# EAGLE design WifiDriver (EAGLE 9.6.2)
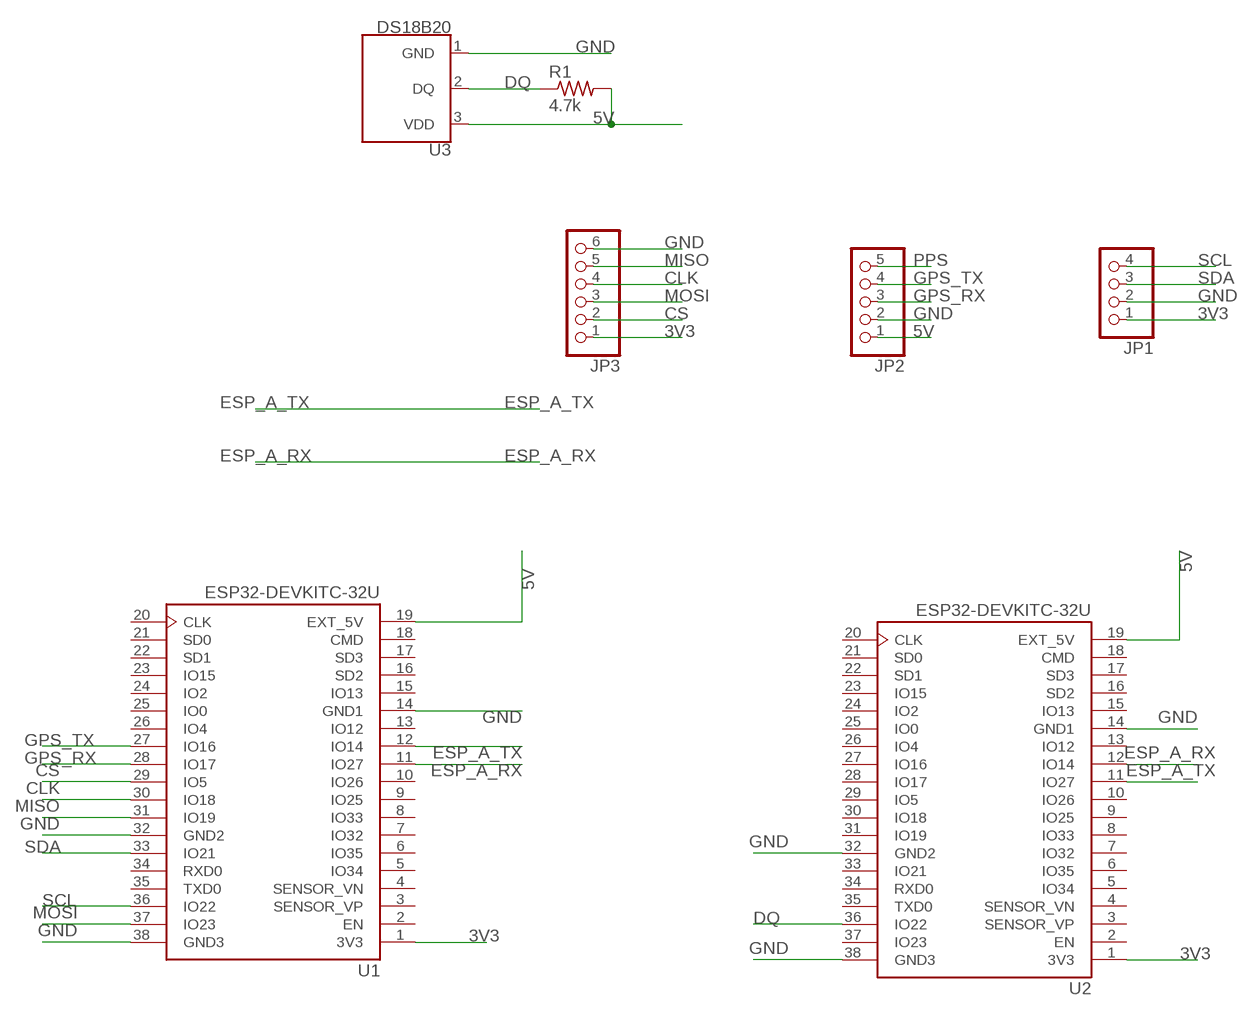
[diagram p0: schematic, sheet 1]

## Parts
JP1  PINHD-1X4  [1X04]
JP2  PINHD-1X5  [1X05]
JP3  PINHD-1X6  [1X06]
R1  4.7k  FLIPFLOP-RES  [0805-THM]
U1  ESP32-DEVKITC-32U  [MODULE_ESP32-DEVKITC-32U]
U2  ESP32-DEVKITC-32U  [MODULE_ESP32-DEVKITC-32U]
U3  DS18B20  [TO-92-AMMO]

## Nets
3V3: JP1.1 JP3.1 U1.1(3V3) U2.1(3V3)
5V: JP2.1 R1.2 U1.19(EXT_5V) U2.19(EXT_5V) U3.3(VDD)
CLK: JP3.4 U1.30(IO18)
CS: JP3.2 U1.29(IO5)
DQ: R1.1 U2.36(IO22) U3.2(DQ)
ESP_A_RX: U1.11(IO27) U2.12(IO14)
ESP_A_TX: U1.12(IO14) U2.11(IO27)
GND: JP1.2 JP2.2 JP3.6 U1.14(GND1) U1.32(GND2) U1.38(GND3) U2.14(GND1) U2.32(GND2) U2.38(GND3) U3.1(GND)
GPS_RX: JP2.3 U1.28(IO17)
GPS_TX: JP2.4 U1.27(IO16)
MISO: JP3.5 U1.31(IO19)
MOSI: JP3.3 U1.37(IO23)
PPS: JP2.5
SCL: JP1.4 U1.36(IO22)
SDA: JP1.3 U1.33(IO21)
Unconnected: U1.2(EN) U1.3(SENSOR_VP) U1.4(SENSOR_VN) U1.5(IO34) U1.6(IO35) U1.7(IO32) U1.8(IO33) U1.9(IO25) U1.10(IO26) U1.13(IO12) U1.15(IO13) U1.16(SD2) U1.17(SD3) U1.18(CMD) U1.20(CLK) U1.21(SD0) U1.22(SD1) U1.23(IO15) U1.24(IO2) U1.25(IO0) U1.26(IO4) U1.34(RXD0) U1.35(TXD0) U2.2(EN) U2.3(SENSOR_VP) U2.4(SENSOR_VN) U2.5(IO34) U2.6(IO35) U2.7(IO32) U2.8(IO33) U2.9(IO25) U2.10(IO26) U2.13(IO12) U2.15(IO13) U2.16(SD2) U2.17(SD3) U2.18(CMD) U2.20(CLK) U2.21(SD0) U2.22(SD1) U2.23(IO15) U2.24(IO2) U2.25(IO0) U2.26(IO4) U2.27(IO16) U2.28(IO17) U2.29(IO5) U2.30(IO18) U2.31(IO19) U2.33(IO21) U2.34(RXD0) U2.35(TXD0) U2.37(IO23)

## Library data of the parts
JP1 = pinhead:PINHD-1X4: PIN HEADER
JP2 = pinhead:PINHD-1X5: PIN HEADER
JP3 = pinhead:PINHD-1X6: PIN HEADER
R1 = adafruit:FLIPFLOP-RES: Flip Flop resistor An 0805 resistor inside a standard 1/4W 5% resistor. Makes for easy mods
U1 U2 = ESP32-DEVKITC-32U:ESP32-DEVKITC-32U: ESP32-DEVKITC Check availability <https://pricing.snapeda.com/parts/ESP32-DEVKITC-32U/Espressif%20Systems/view-part?ref=eda>; AVAILABILITY: In Stock; DESCRIPTION: ESP32-WROOM-32UE series Transceiver; 802.11 b/g/n (Wi-Fi, WiFi, WLAN), Bluetooth® Smart Ready 4.x Dual Mode Evaluation Board; MF: Espressif Systems; MP: ESP32-DEVKITC-32U; PACKAGE: CUSTOM-38 ESPRESSIF; PRICE: None
U3 = SparkFun-Sensors:DS18B20: Dallas/Maxim DS18B20 1-Wire Temperature Sensor The DS18B20 reports degrees C with 9 to 12-bit precision, -55C to 125C (+/-0.5C). Each sensor has a unique 64-Bit Serial number etched into it - allows for a huge number of sensors to be used on one data bus. Datasheet <http://datasheets.maximintegrated.com/en/ds/DS18B20.pdf> SparkFun Products One Wire Digital Temperature Sensor - DS18B20 <https://www.sparkfun.com/products/245> (SEN-00245); STORE_ID: SEN-00245

## Board
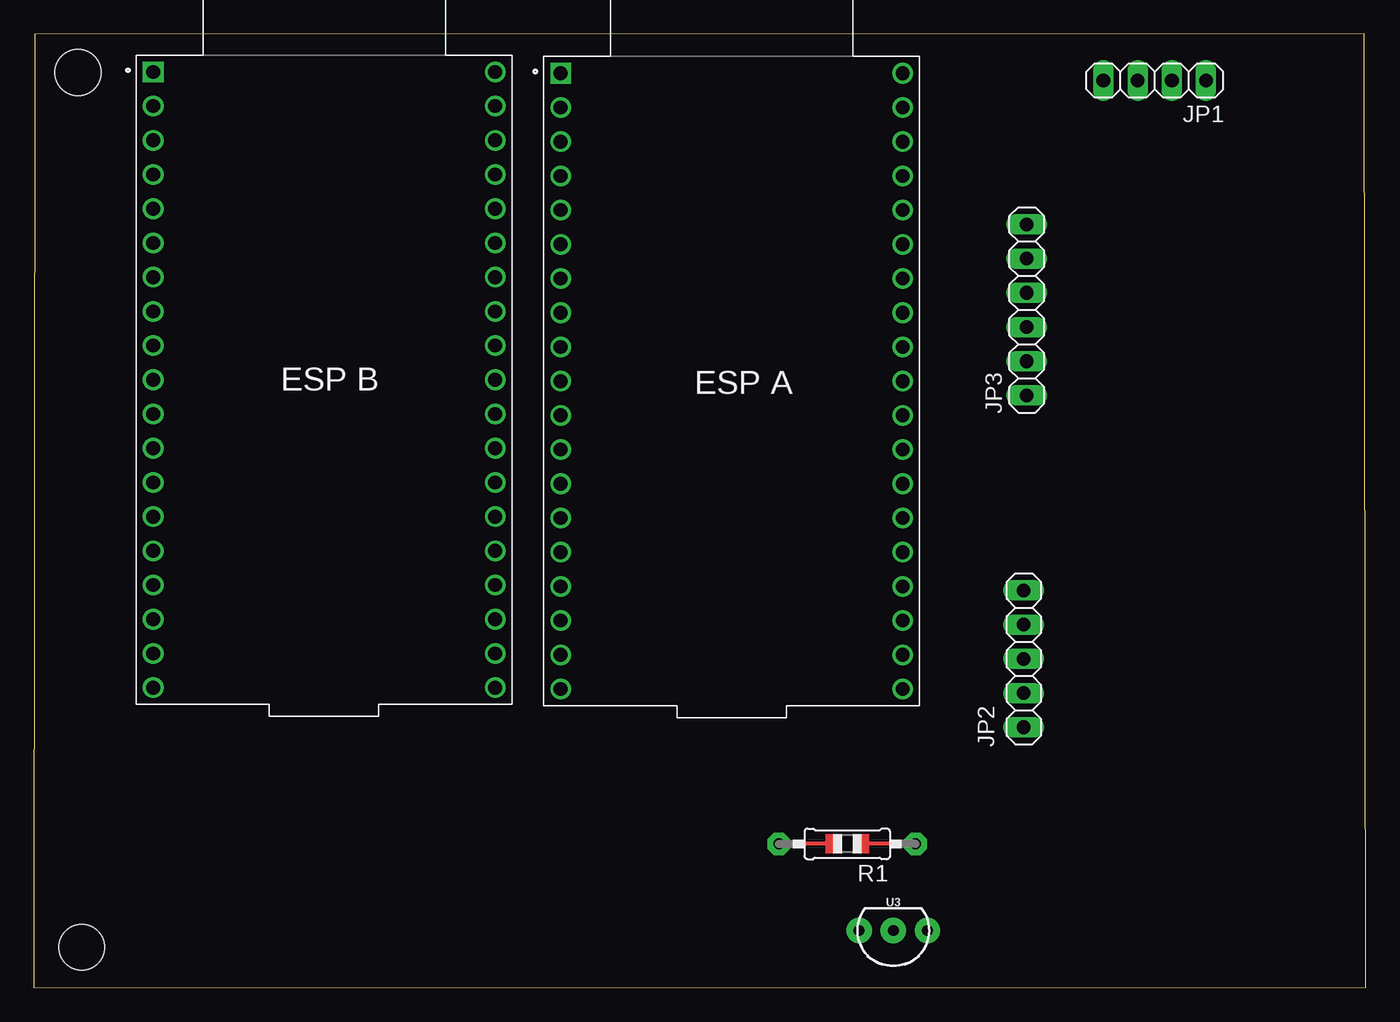
[diagram p1: board, top side]
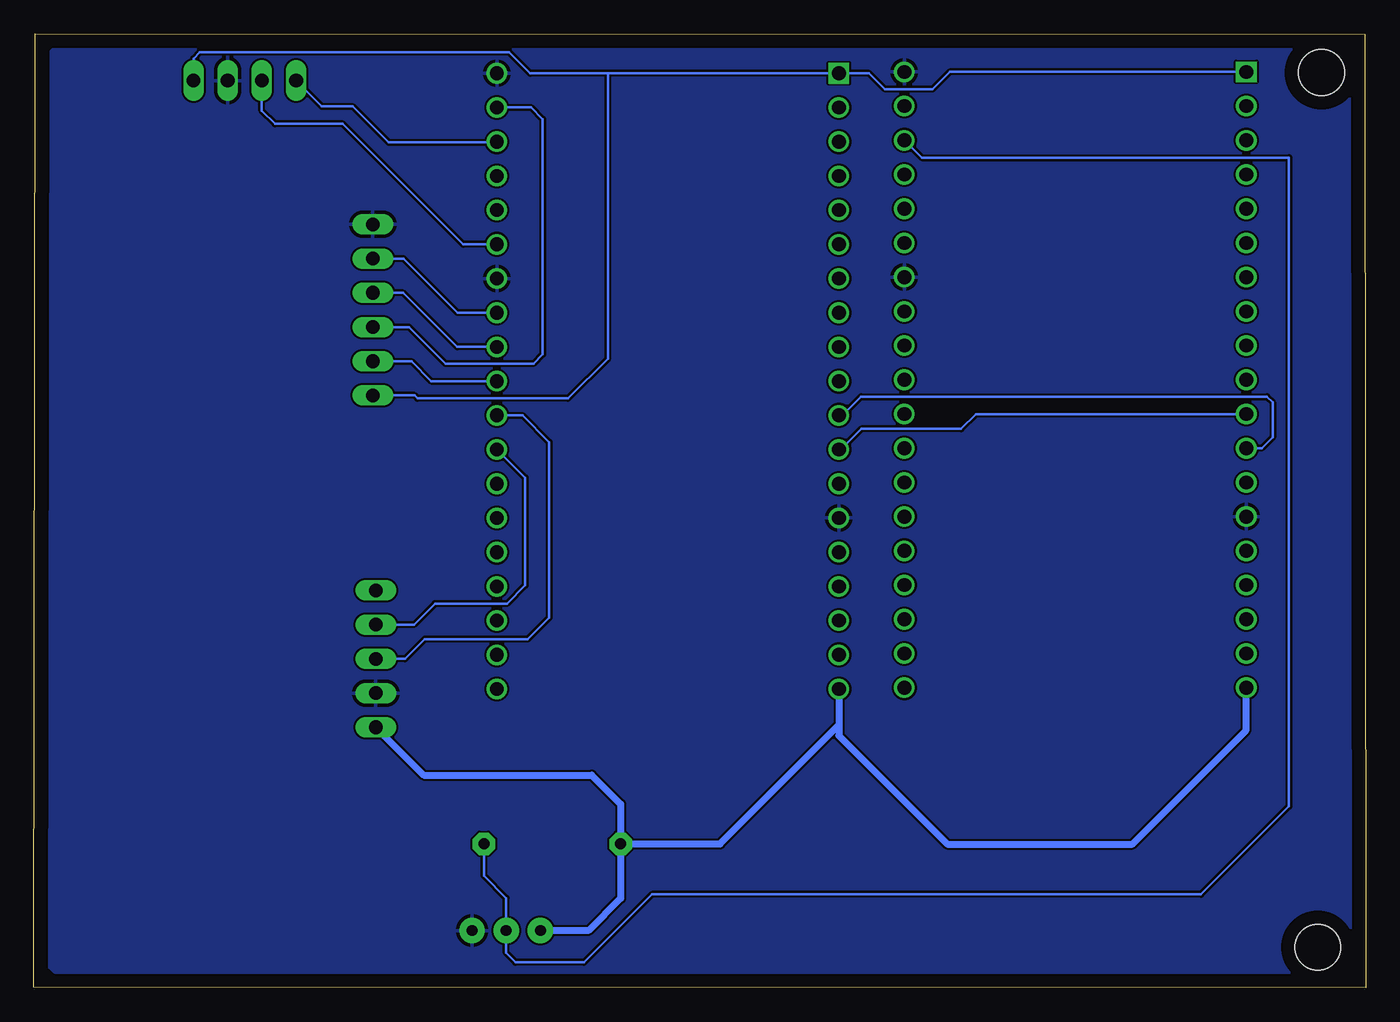
[diagram p2: board, bottom side, seen from below]

Size 98.95 x 70.85 mm. Coordinates in mm from the lower left corner, seen from the top.
Outline: 0,0 98.95,0.03 98.83,70.85 0.09,70.82 0,0
Copper layers (1*16): Top 0.035mm / dielectric 1.5mm / Bottom 0.035mm
Design rules "default": minimum track width 6mil, minimum drill 0.35mm, track to track 6mil, track to pad 6mil, pad to pad 6mil, via to via 6mil, smd to smd 6mil, copper to edge 40mil, drill to drill 6mil, minimum pad ring 10mil, minimum via ring 8mil, stop-mask expansion 4mil, vias tented up to drill 0mil, thermal gap 10mil
Holes 3.4 mm at 3.29,67.97 3.58,3.01

### Footprints (pad centres in the part's own frame; a part is rotated, then mirrored left to right if it is on the bottom)
1X04 = drill 1.016 long: 1 -3.81,0; 2 -1.27,0; 3 1.27,0; 4 3.81,0
1X05 = drill 1.016 long: 1 -5.08,0; 2 -2.54,0; 3 0,0; 4 2.54,0; 5 5.08,0
1X06 = drill 1.016 long: 1 -6.35,0; 2 -3.81,0; 3 -1.27,0; 4 1.27,0; 5 3.81,0; 6 6.35,0
0805-THM = drill 0.813 pad 1.676 octagon: 1 -5.08,0; 2 5.08,0
MODULE_ESP32-DEVKITC-32U = drill 1.02 square: 1 -12.7,22.85 | drill 1.02: 2 -12.7,20.31; 3 -12.7,17.77; 4 -12.7,15.23; 5 -12.7,12.69; 6 -12.7,10.15; 7 -12.7,7.61; 8 -12.7,5.07; 9 -12.7,2.53; 10 -12.7,-0.01; 11 -12.7,-2.55; 12 -12.7,-5.09; 13 -12.7,-7.63; 14 -12.7,-10.17; 15 -12.7,-12.71; 16 -12.7,-15.25; 17 -12.7,-17.79; 18 -12.7,-20.33; 19 -12.7,-22.87; 20 12.7,-22.87; 21 12.7,-20.33; 22 12.7,-17.79; 23 12.7,-15.25; 24 12.7,-12.71; 25 12.7,-10.17; 26 12.7,-7.63; 27 12.7,-5.09; 28 12.7,-2.55; 29 12.7,-0.01; 30 12.7,2.53; 31 12.7,5.07; 32 12.7,7.61; 33 12.7,10.15; 34 12.7,12.69; 35 12.7,15.23; 36 12.7,17.77; 37 12.7,20.31; 38 12.7,22.85
TO-92-AMMO = drill 0.813 pad 1.88: 1 -2.54,0; 2 0,0; 3 2.54,0

### Placement (x,y rotation side)
JP1  83.27,67.37 180 top
JP2  73.54,24.43 90 top
JP3  73.76,50.34 90 top
R1  60.43,10.69 180 top
U1  51.84,45.06 0 top
U2  21.58,45.16 0 top
U3  63.85,4.26 180 top

### Tracks (layer width: path | path; a pad name or v marks a point on that pad's centre or on a via)
3V3
  Bottom 0.2: 56.3,67.91 56.3,46.73 59.26,43.77 70.45,43.77 70.67,43.99 JP3.1 | JP1.1 87.08,69 86.62,69.46 63.62,69.46 62.07,67.91 56.3,67.91 | U2.1 30.9,68.01 32.18,66.73 35.71,66.73 36.89,67.91 U1.1 56.3,67.91
5V
  Top 0.152: R1.2 55.35,10.22
  Bottom 0.508: JP2.1 69.98,15.79 57.5,15.79 55.35,13.64 R1.2 | R1.2 47.97,10.69 39.14,19.52 | U1.19 39.14,19.52 | 39.14,19.52 39.14,18.73 31.09,10.68 17.33,10.68 8.88,19.13 U2.19 | R1.2 55.35,6.65 57.74,4.26 U3.3
CLK
  Bottom 0.2: U1.30 67.49,47.59 71.51,51.61 JP3.4
CS
  Bottom 0.2: JP3.2 73.74,46.51 70.88,46.51 69.42,45.05 U1.29
DQ
  Bottom 0.2: U2.36 32.99,61.64 5.71,61.64 5.71,13.48 12.24,6.95 53.02,6.95 58.07,1.9 63.16,1.9 63.85,2.59 U3.2 63.85,6.67 65.51,8.33 R1.1
ESP_A_RX
  Bottom 0.2: U1.11 38.89,42.51 37.5,43.9 7.34,43.9 6.92,43.48 6.92,40.88 7.73,40.07 U2.12
ESP_A_TX
  Bottom 0.152: 39.14,39.84 U1.12
  Bottom 0.2: U2.11 28.96,42.61 30.07,41.5 37.48,41.5 39.14,39.84
GND
  pour Bottom: 1.16,70.16 97.12,70.16 97.8,69.48 97.8,1.51 96.99,0.7 1.49,0.7 0.62,1.57 0.62,69.64 1.14,70.16
GPS_RX
  Bottom 0.2: U1.28 62.65,42.51 60.66,40.52 60.66,27.5 62.26,25.9 69.9,25.9 71.37,24.43 JP2.3
GPS_TX
  Bottom 0.2: U1.27 62.45,37.88 62.45,29.88 63.79,28.54 69.14,28.54 70.71,26.97 JP2.4
MISO
  Bottom 0.2: U1.31 67.47,50.13 71.49,54.15 JP3.5
MOSI
  Bottom 0.2: U1.37 62.02,65.37 61.15,64.5 61.15,47.04 61.83,46.36 68.37,46.36 71.08,49.07 JP3.3
SCL
  Bottom 0.2: JP1.4 77.55,65.46 75.26,65.46 72.58,62.78 64.59,62.78 U1.36
SDA
  Bottom 0.2: U1.33 67.03,55.21 67.04,55.2 76,64.16 81.03,64.16 82,65.13 JP1.3

### Text on the board
_tsilk: ESP B | ESP A